# Altium project DryBox.PrjPcb
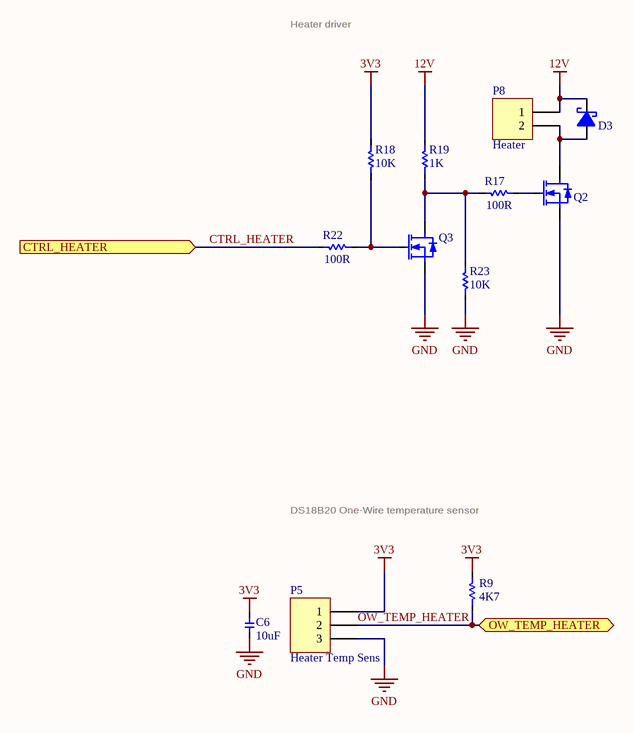
[diagram p0: 03_Heater_Control.SchDoc]
revision: 1.0; sk_ProjectName: DIY Dry Box
2 sheets, 21 parts. Net scope: flat (ports and power ports of the same name join across sheets).
Board file: DryBox.PcbDoc
Sheets:
  03_Heater_Control.SchDoc
  04_Fan_Control.SchDoc

## Sheet 03_Heater_Control.SchDoc
size A4; Author: Sasa Karanovic; Organization: Altium Limited; sk_Title: Heater Control; DocumentNumber: 1; SheetNumber: 3; SheetTotal: 5

### Parts
C6  value 10uF  [0603 - CAP HS]  (hidden comment: Cap)
D3  Diode Schotky  [SOD123F]  (value not drawn)
P5  Heater Temp Sens  [Header 3x1]
P8  Heater  [Header 2x1]
Q2  PSMN9R1-30YL  [LFPAK-8]  (value not drawn)
Q3  DMN62D0U-13  [SOT90P240X100-3N]  (value not drawn)
R9  value 4K7  [0603 - HS]  (hidden comment: Res)
R17  value 100R  [0603 - HS]  (hidden comment: Res)
R18  value 10K  [0603 - HS]  (hidden comment: Res)
R19  value 1K  [0603 - HS]  (hidden comment: Res)
R22  value 100R  [0603 - HS]  (hidden comment: Res)
R23  value 10K  [0603 - HS]  (hidden comment: Res)

### Ports
CTRL_HEATER (in), OW_TEMP_HEATER (bidir)

### Nets
3V3: C6.1 P5.1 R9.1 R18.1
12V: D3.K P8.1 R19.1
GND: C6.2 P5.3 Q2.S Q3.2(S) R23.2
CTRL_HEATER: R22.1 ; port CTRL_HEATER
OW_TEMP_HEATER: P5.2 R9.2 ; port OW_TEMP_HEATER
NetD3_A: D3.A P8.2 Q2.D
NetQ2_G: Q2.G R17.2
NetQ3_1: Q3.1(G) R18.2 R22.2
NetQ3_3: Q3.3(D) R17.1 R19.2 R23.1

### Notes on the sheet
- Heater driver
- DS18B20 One-Wire temperature sensor
- Page
- Title
- www.SasaKaranovic.com <http://www.SasaKaranovic.com>
- of

### Library data of the parts
C6 = Cap: Capacitor; Manufacturer: Samsung Electro-Mechanics; Manufacturer Part Number: CL10A106MO8NQNC; Distributor Part Number: 1276-1870-1-ND; Distributor: DigiKey
D3 = Diode Schotky: Manufacturer: Nexperia USA Inc.; Manufacturer Part Number: PMEG6010CEH,115; Distributor: DigiKey; Distributor Part Number: 1727-3848-1-ND
P5 = Header 3: Header, 3-Pin
P8 = Header 2: Header, 2-Pin
Q2 = PSMN9R1-30YL: MOSFET N-CH 30V 37A LFPAK; Manufacturer: Nexperia USA Inc.; Manufacturer Part Number: PSMN011-30YLC,115; Distributor: DigiKey
Q3 = DMN62D0U-13: MOSFET N-CH 60V 0.38A; Manufacturer: Diodes Incorporated; Manufacturer Part Number: DMN62D0U-13; Distributor: DigiKey; Distributor Part Number: DMN62D0U-13DICT-ND
R9 = Res: Resistor; Manufacturer: Stackpole Electronics Inc; Manufacturer Part Number: RMCF0603FT4K70; Distributor: DigiKey; Distributor Part Number: RMCF0603FT4K70CT-ND
R17 R22 = Res: Resistor; Manufacturer: Stackpole Electronics Inc; Manufacturer Part Number: RMCF0603FT100R; Distributor: DigiKey; Distributor Part Number: RMCF0603FT100RCT-ND
R18 R23 = Res: Resistor; Manufacturer: Stackpole Electronics Inc; Manufacturer Part Number: RMCF0603JT10K0; Distributor: DigiKey; Distributor Part Number: RMCF0603JT10K0CT-ND
R19 = Res: Resistor; Manufacturer: Stackpole Electronics Inc; Manufacturer Part Number: RNCS0603BKE1K00; Distributor: DigiKey; Distributor Part Number: RNCS0603BKE1K00CT-ND

## Sheet 04_Fan_Control.SchDoc
size A4; Author: Sasa Karanovic; Organization: Altium Limited; sk_Title: Fan Control; DocumentNumber: 1; SheetNumber: 4; SheetTotal: 5
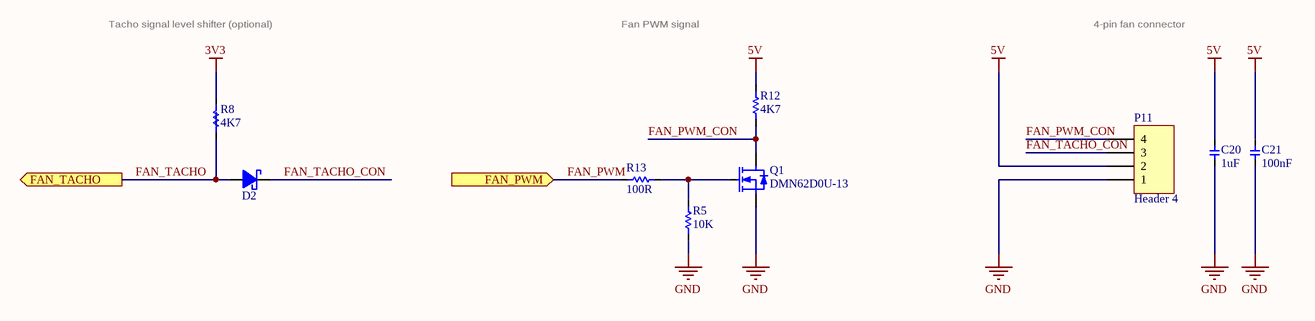
[diagram p1: 04_Fan_Control.SchDoc]

### Parts
C20  value 1uF  [0603 - CAP HS]  (hidden comment: Cap)
C21  value 100nF  [0603 - CAP HS]  (hidden comment: Cap)
D2  Diode Schotky  [SOD123F]  (value not drawn)
P11  Header 4  [Header 4x1]
Q1  DMN62D0U-13  [SOT90P240X100-3N]
R5  value 10K  [0603 - HS]  (hidden comment: Res)
R8  value 4K7  [0603 - HS]  (hidden comment: Res)
R12  value 4K7  [0603 - HS]  (hidden comment: Res)
R13  value 100R  [0603 - HS]  (hidden comment: Res)

### Ports
FAN_PWM (in), FAN_TACHO (out)

### Nets
3V3: R8.2
5V: C20.1 C21.1 P11.2 R12.2
GND: C20.2 C21.2 P11.1 Q1.2(S) R5.2
FAN_PWM: R13.2 ; port FAN_PWM
FAN_PWM_CON: P11.4 Q1.3(D) R12.1
FAN_TACHO: D2.A R8.1 ; port FAN_TACHO
FAN_TACHO_CON: D2.K P11.3
NetQ1_1: Q1.1(G) R5.1 R13.1

### Notes on the sheet
- Tacho signal level shifter (optional)
- Fan PWM signal
- 4-pin fan connector
- Page
- Title
- www.SasaKaranovic.com <http://www.SasaKaranovic.com>
- of

### Library data of the parts
C20 = Cap: Capacitor; Manufacturer: Samsung Electro-Mechanics; Manufacturer Part Number: CL10A105KB8NNNC; Distributor Part Number: 1276-1860-1-ND; Distributor: DigiKey
C21 = Cap: Capacitor; Manufacturer: Samsung Electro-Mechanics; Manufacturer Part Number: CL10B103KB8NNNC; Distributor Part Number: 1276-1009-1-ND; Distributor: DigiKey
D2 = Diode Schotky: as D3 on sheet 03_Heater_Control; Distributor: DigiKey; Distributor Part Number: 1727-3848-1-ND
P11 = Header 4: Header, 4-Pin
Q1 = DMN62D0U-13: as Q3 on sheet 03_Heater_Control; Manufacturer Part Number: DMN62D0U-13; Distributor: DigiKey; Distributor Part Number: DMN62D0U-13DICT-ND
R5 = Res: as R18 on sheet 03_Heater_Control; Distributor: DigiKey; Distributor Part Number: RMCF0603JT10K0CT-ND
R8 R12 = Res: as R9 on sheet 03_Heater_Control; Distributor: DigiKey; Distributor Part Number: RMCF0603FT4K70CT-ND
R13 = Res: as R17 on sheet 03_Heater_Control; Distributor: DigiKey; Distributor Part Number: RMCF0603FT100RCT-ND

## Nets that join several sheets
3V3: 03_Heater_Control (C6.1 P5.1 R9.1 R18.1), 04_Fan_Control (R8.2)
GND: 03_Heater_Control (5 pins), 04_Fan_Control (5 pins)